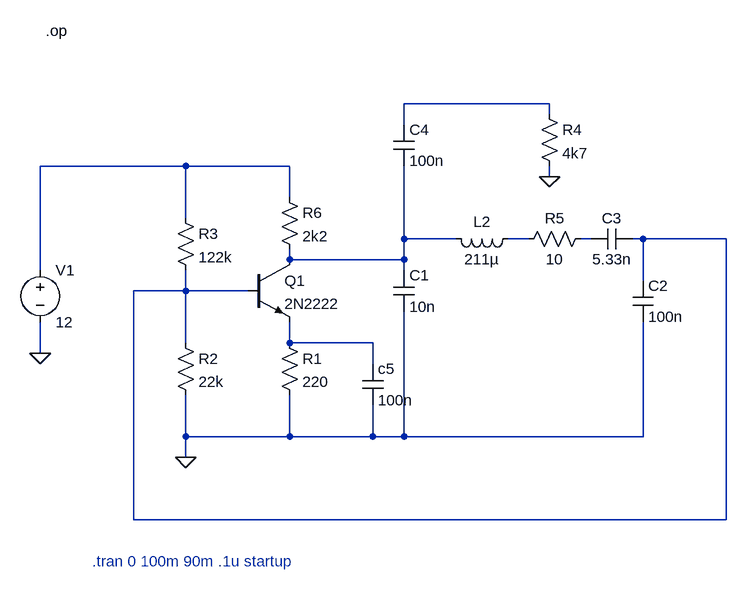
[diagram p0: schematic labosc1.asc]
labosc1.asc, the LTspice schematic file:
Version 4
SHEET 1 3972 680
WIRE 672 -112 448 -112
WIRE 672 -96 672 -112
WIRE 448 -80 448 -112
WIRE 112 -16 -112 -16
WIRE 272 -16 112 -16
WIRE 672 0 672 -16
WIRE 272 32 272 -16
WIRE 112 64 112 -16
WIRE 448 96 448 -16
WIRE 528 96 448 96
WIRE 640 96 608 96
WIRE 736 96 720 96
WIRE 816 96 800 96
WIRE 944 96 816 96
WIRE 272 128 272 112
WIRE 448 128 448 96
WIRE 448 128 272 128
WIRE -112 144 -112 -16
WIRE 448 144 448 128
WIRE 816 160 816 96
WIRE 112 176 112 144
WIRE 112 176 32 176
WIRE 208 176 112 176
WIRE 112 256 112 176
WIRE 272 256 272 224
WIRE 400 256 272 256
WIRE -112 272 -112 224
WIRE 400 288 400 256
WIRE 112 400 112 336
WIRE 272 400 272 336
WIRE 272 400 112 400
WIRE 400 400 400 352
WIRE 400 400 272 400
WIRE 448 400 448 208
WIRE 448 400 400 400
WIRE 816 400 816 224
WIRE 816 400 448 400
WIRE 112 432 112 400
WIRE 32 528 32 176
WIRE 944 528 944 96
WIRE 944 528 32 528
FLAG -112 272 0
FLAG 112 432 0
FLAG 672 0 0
SYMBOL npn 208 128 R0
SYMATTR InstName Q1
SYMATTR Value 2N2222
SYMBOL res 256 240 R0
SYMATTR InstName R1
SYMATTR Value 220
SYMBOL res 96 240 R0
SYMATTR InstName R2
SYMATTR Value 22k
SYMBOL res 96 48 R0
SYMATTR InstName R3
SYMATTR Value 122k
SYMBOL voltage -112 128 R0
WINDOW 123 0 0 Left 0
WINDOW 39 0 0 Left 0
SYMATTR InstName V1
SYMATTR Value 12
SYMBOL cap 384 288 R0
SYMATTR InstName c5
SYMATTR Value 100n
SYMBOL cap 432 144 R0
SYMATTR InstName C1
SYMATTR Value 10n
SYMBOL ind 624 80 R90
WINDOW 0 5 56 VBottom 2
WINDOW 3 32 56 VTop 2
SYMATTR InstName L2
SYMATTR Value 211µ
SYMBOL cap 800 160 R0
SYMATTR InstName C2
SYMATTR Value 100n
SYMBOL cap 800 80 R90
WINDOW 0 0 32 VBottom 2
WINDOW 3 32 32 VTop 2
SYMATTR InstName C3
SYMATTR Value 5.33n
SYMBOL cap 432 -80 R0
SYMATTR InstName C4
SYMATTR Value 100n
SYMBOL res 656 -112 R0
SYMATTR InstName R4
SYMATTR Value 4k7
SYMBOL res 736 80 R90
WINDOW 0 0 56 VBottom 2
WINDOW 3 32 56 VTop 2
SYMATTR InstName R5
SYMATTR Value 10
SYMBOL res 256 16 R0
SYMATTR InstName R6
SYMATTR Value 2k2
TEXT -104 -224 Left 2 !.op
TEXT -32 592 Left 2 ;.tran 0 100m 90m .1u startup

The netlist it stands for:
* labosc1.asc
Q1 N003 N006 N007 0 2N2222
R1 N007 0 220
R2 N006 0 22k
R3 N002 N006 122k
V1 N002 0 12
c5 N007 0 100n
C1 N003 0 10n
L2 N004 N003 211µ
C2 N006 0 100n
C3 N006 N005 5.33n
C4 N001 N003 100n
R4 N001 0 4k7
R5 N005 N004 10
R6 N002 N003 2k2
.model NPN NPN
.model PNP PNP
.lib standard.bjt
.op
* .tran 0 100m 90m .1u startup
.backanno
.end